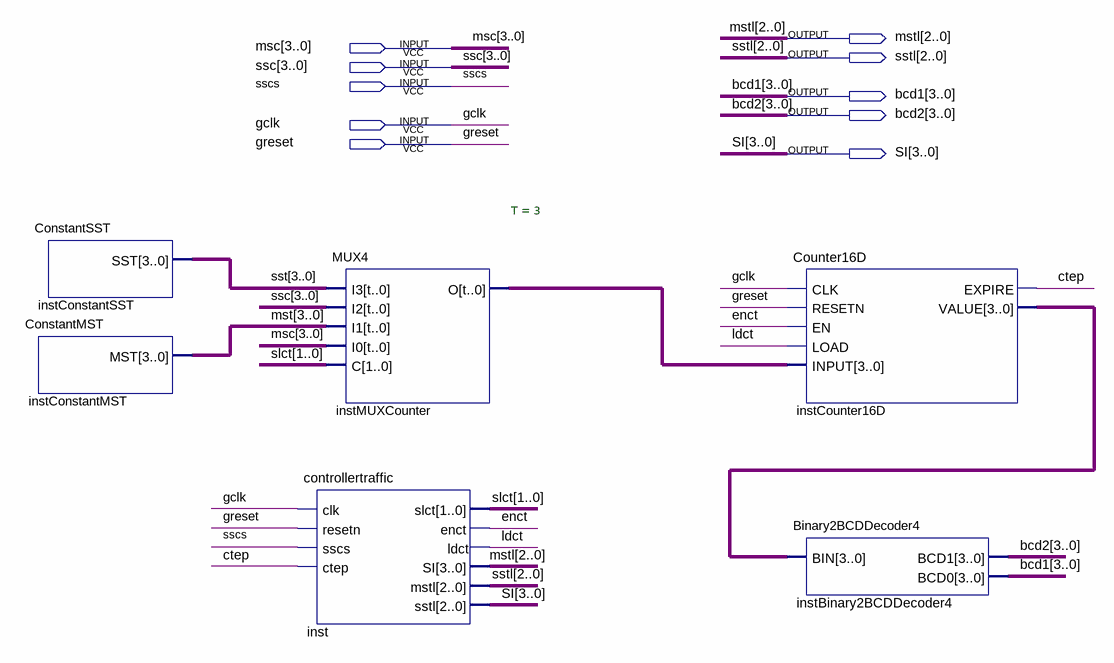
[diagram p0: schematic sheet]
// Quartus schematic TrafficLightController.bdf as structural Verilog: 6 symbols, 10 pins
module TrafficLightController (
  input  [3:0] msc,
  input  [3:0] ssc,
  input  sscs,
  input  gclk,
  input  greset,
  output [2:0] mstl,
  output [2:0] sstl,
  output [3:0] bcd1,
  output [3:0] bcd2,
  output [3:0] SI
);

  wire ctep, enct, ldct;
  wire [1:0] slct;
  wire [3:0] instCounter16D_value, instMUXCounter_o, mst, sst;

  ConstantSST instConstantSST (.SST(sst));
  ConstantMST instConstantMST (.MST(mst));
  MUX4 #(.T(3)) instMUXCounter (.I3(sst), .I2(ssc), .I1(mst), .I0(msc), .C(slct), .O(instMUXCounter_o));
  controllertraffic inst (
    .clk(gclk), .resetn(greset), .sscs(sscs), .ctep(ctep), .slct(slct), .enct(enct), .ldct(ldct), .SI(mstl),
    .mstl(sstl), .sstl(SI));
  Counter16D instCounter16D (
    .CLK(gclk), .RESETN(greset), .EN(enct), .LOAD(ldct), .INPUT(instMUXCounter_o), .EXPIRE(ctep),
    .VALUE(instCounter16D_value));
  Binary2BCDDecoder4 instBinary2BCDDecoder4 (.BIN(instCounter16D_value), .BCD1(bcd2), .BCD0(bcd1));
endmodule
